# Altium schematic sheet POWER_Module.SchDoc
size A; SheetNumber: 2; SheetTotal: 6
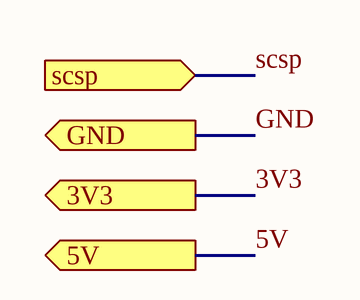
[diagram p0: POWER_Module.SchDoc]

## Ports
3V3 (out), 5V (out), GND (out), scsp (in)

## Nets
3V3: port 3V3
5V: port 5V
GND: port GND
scsp: port scsp